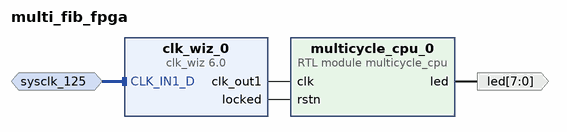
[diagram p0: block diagram of the top level]
# Vivado block design multi_fib_fpga, xcku040-ffva1156-2-e, Vivado 2019.2.1
create_bd_design multi_fib_fpga

create_bd_intf_port -mode Slave -vlnv xilinx.com:interface:diff_clock_rtl:1.0 sysclk_125
set_property -dict {CONFIG.FREQ_HZ 125000000} [get_bd_intf_ports sysclk_125]
create_bd_port -dir O -from 7 -to 0 -type data led

create_bd_cell -type ip -vlnv xilinx.com:ip:clk_wiz:6.0 clk_wiz_0
set_property -dict {CONFIG.CLK_IN1_BOARD_INTERFACE sysclk_125 CONFIG.USE_BOARD_FLOW true} [get_bd_cells clk_wiz_0]
create_bd_cell -type module -reference multicycle_cpu multicycle_cpu_0

# ---- connections ----

connect_bd_intf_net -intf_net sysclk_125_1 [get_bd_intf_ports sysclk_125] [get_bd_intf_pins clk_wiz_0/CLK_IN1_D]
connect_bd_net [get_bd_pins multicycle_cpu_0/led] [get_bd_ports led]
connect_bd_net [get_bd_pins clk_wiz_0/clk_out1] [get_bd_pins multicycle_cpu_0/clk]
connect_bd_net [get_bd_pins clk_wiz_0/locked] [get_bd_pins multicycle_cpu_0/rstn]

validate_bd_design
save_bd_design
